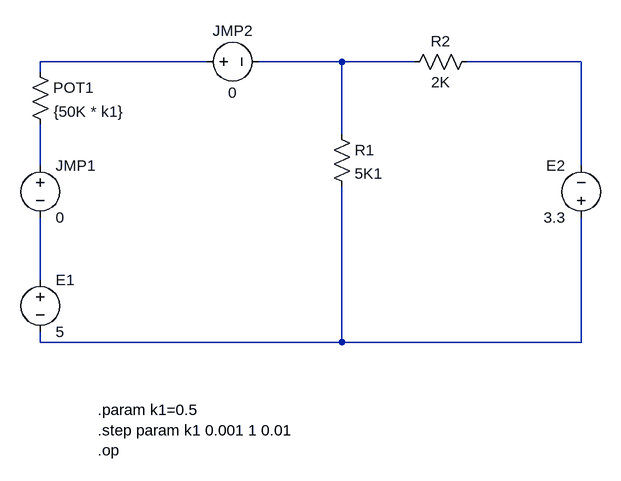
[diagram p0: schematic lab31.asc]
lab31.asc, the LTspice schematic file:
Version 4.1
SHEET 1 880 680
WIRE -112 -96 -368 -96
WIRE 96 -96 -32 -96
WIRE 208 -96 96 -96
WIRE 464 -96 288 -96
WIRE -368 -80 -368 -96
WIRE 96 16 96 -96
WIRE -368 64 -368 0
WIRE 464 64 464 -96
WIRE -368 240 -368 144
WIRE -368 336 -368 320
WIRE 96 336 96 96
WIRE 96 336 -368 336
WIRE 464 336 464 144
WIRE 464 336 96 336
SYMBOL voltage -368 224 R0
WINDOW 123 0 0 Left 0
WINDOW 39 0 0 Left 0
SYMATTR InstName E1
SYMATTR Value 5
SYMBOL voltage -368 48 R0
WINDOW 123 0 0 Left 0
WINDOW 39 0 0 Left 0
SYMATTR InstName JMP1
SYMATTR Value 0
SYMBOL res -384 -96 R0
WINDOW 3 37 77 Left 2
SYMATTR Value {50K * k1}
SYMATTR InstName POT1
SYMBOL res 80 0 R0
SYMATTR InstName R1
SYMATTR Value 5K1
SYMBOL res 304 -112 R90
WINDOW 0 0 56 VBottom 2
WINDOW 3 32 56 VTop 2
SYMATTR InstName R2
SYMATTR Value 2K
SYMBOL voltage 464 160 R180
WINDOW 0 24 96 Left 2
WINDOW 3 24 16 Left 2
WINDOW 123 0 0 Left 0
WINDOW 39 0 0 Left 0
SYMATTR InstName E2
SYMATTR Value 3.3
SYMBOL voltage -128 -96 R270
WINDOW 0 32 56 VTop 2
WINDOW 3 -32 56 VBottom 2
WINDOW 123 0 0 Left 0
WINDOW 39 0 0 Left 0
SYMATTR InstName JMP2
SYMATTR Value 0
TEXT -280 440 Left 2 !.param k1=0.5\n.step param k1 0.001 1 0.01\n.op

The netlist it stands for:
* lab31.asc
V§E1 N005 N006 5
V§JMP1 N004 N005 0
R§POT1 N001 N004 {50K * k1}
R1 N002 N006 5K1
R2 N003 N002 2K
V§E2 N006 N003 3.3
V§JMP2 N001 N002 0
.param k1=0.5
.step param k1 0.001 1 0.01
.op
.backanno
.end